# EAGLE design BARBOT (EAGLE 8.6.1)
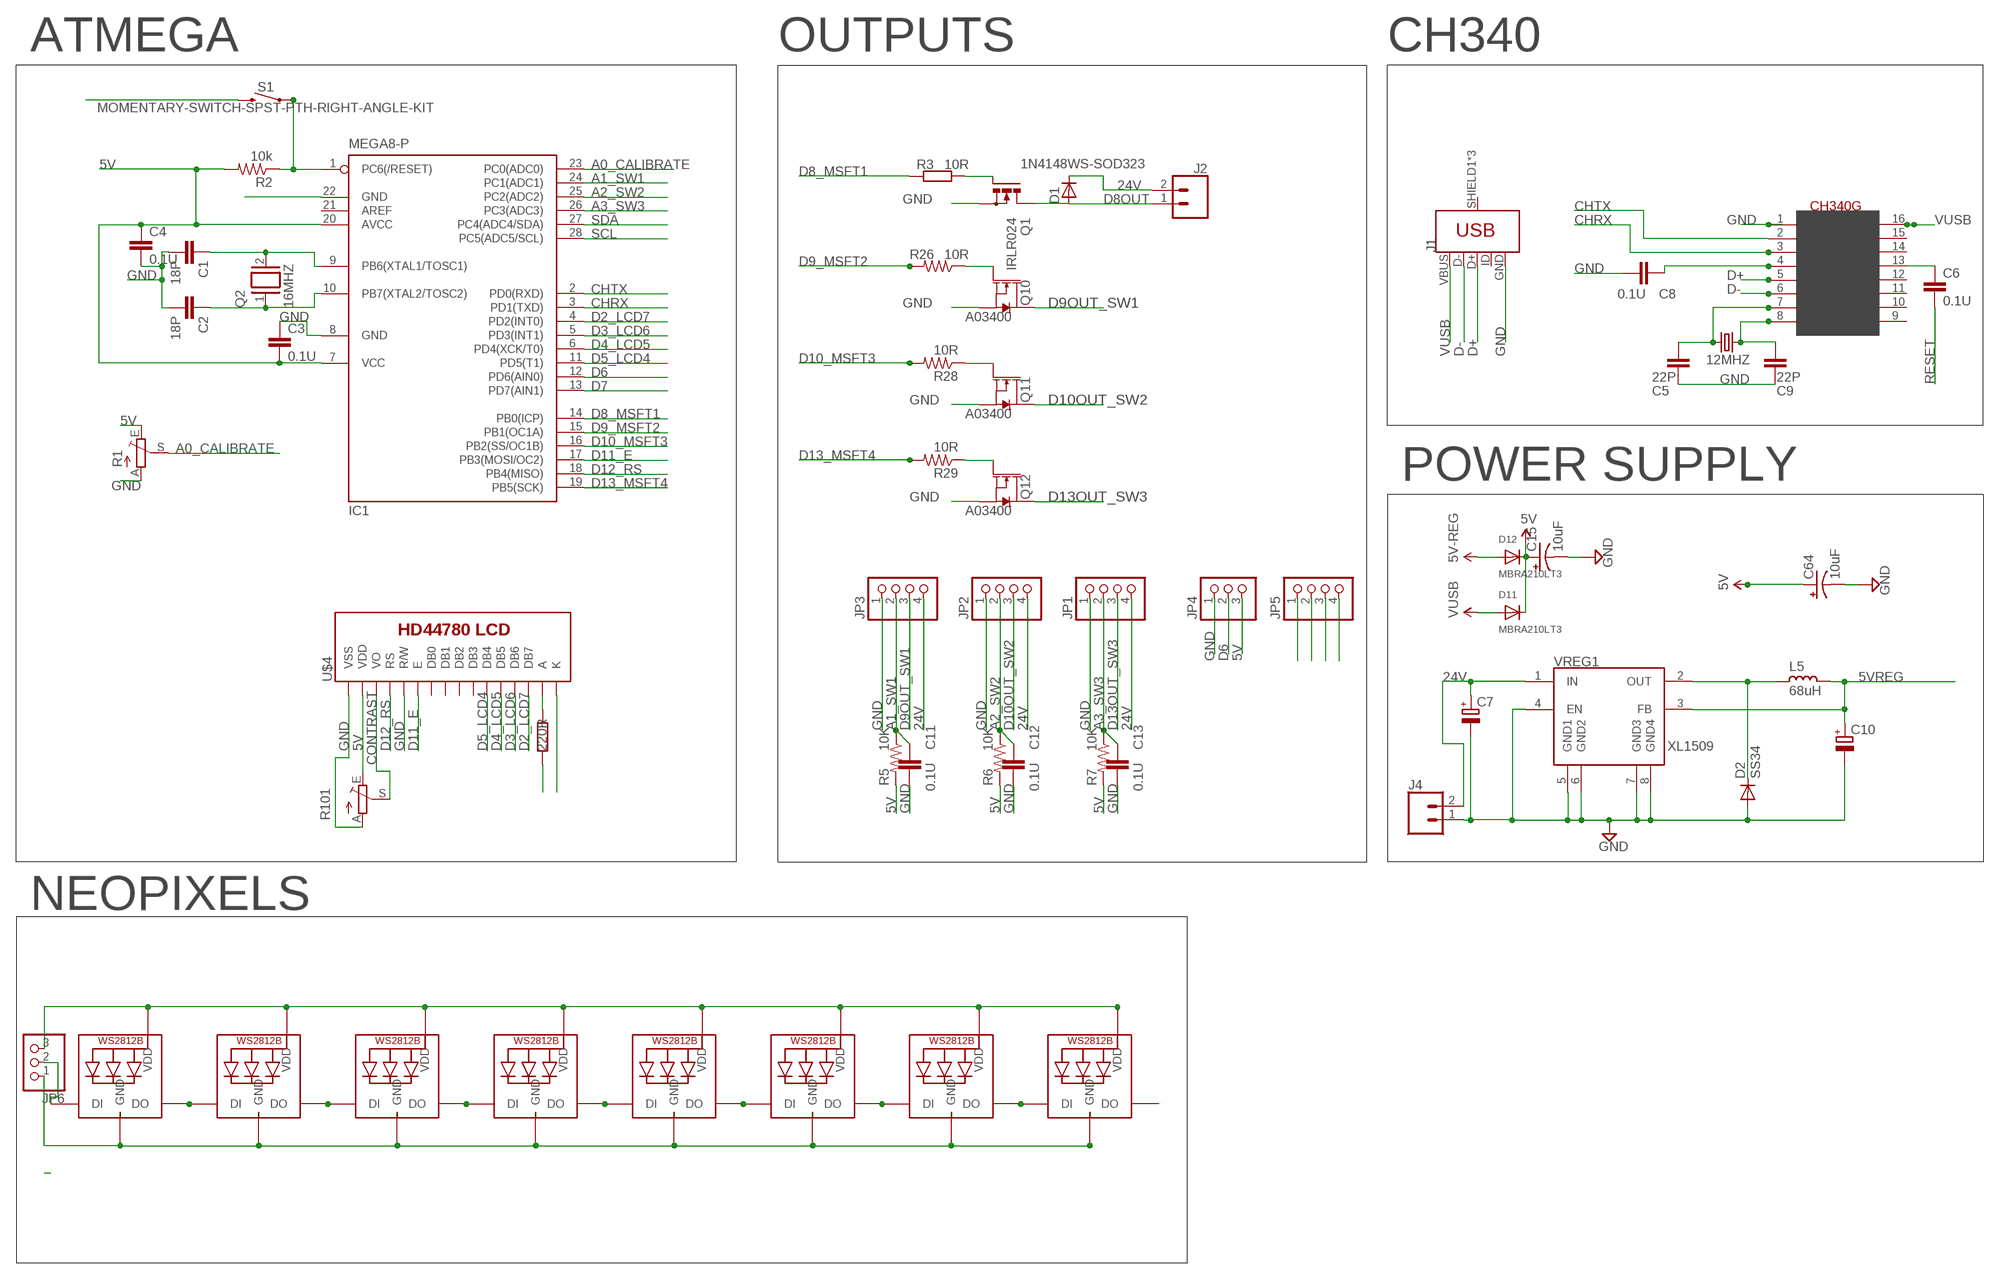
[diagram p0: schematic, sheet 1]

## Parts
12MHZ  12MHZ  CRYSTALHC49U70  [HC49U70]
C1  18P  C-EUC1206  [C1206]
C2  18P  C-EUC1206  [C1206]
C3  0.1U  C-EUC1206  [C1206]
C4  0.1U  C-EUC1206  [C1206]
C5  22P  C-EUC1206  [C1206]
C6  0.1U  C-EUC1206  [C1206]
C7  CPOL-EUE3.5-10  [E3,5-10]
C8  0.1U  C-EUC1206  [C1206]
C9  22P  C-EUC1206  [C1206]
C10  CPOL-EUE3.5-10  [E3,5-10]
C11  0.1U  C-EUC1206  [C1206]
C12  0.1U  C-EUC1206  [C1206]
C13  0.1U  C-EUC1206  [C1206]
C15  10uF  CAP_POL1206  [EIA3216]
C64  10uF  CAP_POL1206  [EIA3216]
D1  1N4148WS-SOD323  D-SOD-80  [SOD80]
D2  SS34  DIODE-DO-214AC  [DO-214AC]
D11  MBRA210LT3  DIODESMA  [SMADIODE]
D12  MBRA210LT3  DIODESMA  [SMADIODE]
IC1  MEGA8-P  [DIL28-3]
J1  USB_MICRO-BREDUCED_PASTE  [USB-B-MICRO-SMD_RED_PASTE]
J2  CONN_023.5MM  [SCREWTERMINAL-3.5MM-2]
J4  CONN_023.5MM  [SCREWTERMINAL-3.5MM-2]
JP1  PINHD-1X4  [1X04]
JP2  PINHD-1X4  [1X04]
JP3  PINHD-1X4  [1X04]
JP4  PINHD-1X3  [1X03]
JP5  PINHD-1X4  [1X04]
JP6  PINHD-1X3  [1X03]
L5  68uH  L_CD75  [CD75]
LED1  WS2812B5050  [WS2812B]
LED2  WS2812B5050  [WS2812B]
LED3  WS2812B5050  [WS2812B]
LED4  WS2812B5050  [WS2812B]
LED5  WS2812B5050  [WS2812B]
LED6  WS2812B5050  [WS2812B]
LED7  WS2812B5050  [WS2812B]
LED8  WS2812B5050  [WS2812B]
Q1  IRLR024  N-POWER-MOSFETDPAK-MOSFET  [D-PAK_TO252AA]
Q2  16MHZ  XTAL/S  [QS]
Q10  A03400  MOSFET-NCH-AO3404A  [SOT23-3]
Q11  A03400  MOSFET-NCH-AO3404A  [SOT23-3]
Q12  A03400  MOSFET-NCH-AO3404A  [SOT23-3]
R1  TRIM_EU-B25P  [B25P]
R2  10k  R-US_R1206  [R1206]
R3  10R  R-EU_R1206  [R1206]
R4  220R  R-EU_R1206  [R1206]
R5  10K  R-US_R1206  [R1206@1]
R6  10K  R-US_R1206  [R1206@1]
R7  10K  R-US_R1206  [R1206@1]
R26  10R  R-US_R1206  [R1206@1]
R28  10R  R-US_R1206  [R1206@1]
R29  10R  R-US_R1206  [R1206@1]
R101  TRIM_EU-B25P  [B25P]
S1  MOMENTARY-SWITCH-SPST-PTH-RIGHT-ANGLE-KIT  [TACTILE_SWITCH_PTH_RIGHT_ANGLE_KIT]
U$2  CH340G  [SOIC16]
U$4  LCD-HD447804-HOLES16X2-4-HOLES  [LCD-16X2-4HOLES]
VREG1  XL1509  [SO08]

## Nets
5V: C3.2 C4.1 C15.A(+) C64.A(+) D11.C D12.C IC1.7(VCC) IC1.20(AVCC) JP4.3 JP5.2 JP6.3 LED1.1-VDD(VDD) LED2.1-VDD(VDD) LED3.1-VDD(VDD) LED4.1-VDD(VDD) LED5.1-VDD(VDD) LED6.1-VDD(VDD) LED7.1-VDD(VDD) LED8.1-VDD(VDD) R1.E R2.2 R4.1 R5.2 R6.2 R7.2 R101.E U$4.2(VDD)
5VREG: C10.+ D12.A L5.1 VREG1.3(FB) ; supply symbol labelled 5V-REG
24V: C7.+ D1.1(C) J2.2 J4.2 JP1.4 JP2.4 JP3.4 VREG1.1(IN)
A0_CALIBRATE: IC1.23(PC0(ADC0)) R1.S
A1_SW1: C11.1 IC1.24(PC1(ADC1)) JP3.2 R5.1
A2_SW2: C12.1 IC1.25(PC2(ADC2)) JP2.2 R6.1
A3_SW3: C13.1 IC1.26(PC3(ADC3)) JP1.2 R7.1
CHRX: IC1.3(PD1(TXD)) U$2.3(RX)
CHTX: IC1.2(PD0(RXD)) U$2.2(TX)
CONTRAST: R101.S U$4.3(VO)
D2_LCD7: IC1.4(PD2(INT0)) U$4.14(DB7)
D3_LCD6: IC1.5(PD3(INT1)) U$4.13(DB6)
D4_LCD5: IC1.6(PD4(XCK/T0)) U$4.12(DB5)
D5_LCD4: IC1.11(PD5(T1)) U$4.11(DB4)
D6: IC1.12(PD6(AIN0)) JP4.2
D7: IC1.13(PD7(AIN1))
D8_MSFT1: IC1.14(PB0(ICP)) R3.1
D8OUT: D1.2(A) J2.1 Q1.4(D)
D9_MSFT2: IC1.15(PB1(OC1A)) R26.2
D9OUT_SW1: JP3.3 Q10.3(D)
D10_MSFT3: IC1.16(PB2(SS/OC1B)) R28.2
D10OUT_SW2: JP2.3 Q11.3(D)
D11_E: IC1.17(PB3(MOSI/OC2)) U$4.6(E)
D12_RS: IC1.18(PB4(MISO)) U$4.4(RS)
D13_MSFT4: IC1.19(PB5(SCK)) R29.2
D13OUT_SW3: JP1.3 Q12.3(D)
D+: J1.D+ U$2.5(D+)
D-: J1.D- U$2.6(D-)
GND: C1.2 C2.2 C3.1 C4.2 C5.2 C7.- C8.2 C9.2 C10.- C11.2 C12.2 C13.2 C15.C(-) C64.C(-) D2.2(A) IC1.8(GND) IC1.22(GND) J1.GND J4.1 JP1.1 JP2.1 JP3.1 JP4.1 JP5.1 JP6.1 LED1.3-GND(GND) LED2.3-GND(GND) LED3.3-GND(GND) LED4.3-GND(GND) LED5.3-GND(GND) LED6.3-GND(GND) LED7.3-GND(GND) LED8.3-GND(GND) Q1.3(S) Q10.2(S) Q11.2(S) Q12.2(S) R1.A R101.A S1.2 U$2.1(GND) U$4.1(VSS) U$4.5(R/W) U$4.16(K) VREG1.4(EN) VREG1.5(GND1) VREG1.6(GND2) VREG1.7(GND3) VREG1.8(GND4)
N$1: Q1.1(G) R3.2
N$2: C6.1 U$2.13(DTR)
N$3: C1.1 IC1.9(PB6(XTAL1/TOSC1)) Q2.2
N$5: C2.1 IC1.10(PB7(XTAL2/TOSC2)) Q2.1
N$9: 12MHZ.1 C5.1 U$2.7(XI)
N$10: R4.2 U$4.15(A)
N$11: 12MHZ.2 C9.1 U$2.8(XO)
N$12: C8.1 U$2.4(V3)
N$17: LED1.2-DOUT(DO) LED2.4-DIN(DI)
N$18: LED2.2-DOUT(DO) LED3.4-DIN(DI)
N$19: LED3.2-DOUT(DO) LED4.4-DIN(DI)
N$20: LED4.2-DOUT(DO) LED5.4-DIN(DI)
N$21: LED5.2-DOUT(DO) LED6.4-DIN(DI)
N$22: LED6.2-DOUT(DO) LED7.4-DIN(DI)
N$23: LED7.2-DOUT(DO) LED8.4-DIN(DI)
N$27: JP6.2 LED1.4-DIN(DI)
N$81: Q10.1(G) R26.1
N$82: Q11.1(G) R28.1
N$83: Q12.1(G) R29.1
N$292: D2.1(C) L5.2 VREG1.2(OUT)
RESET: C6.2 IC1.1(PC6(/RESET)) R2.1 S1.1
SCL: IC1.28(PC5(ADC5/SCL)) JP5.4
SDA: IC1.27(PC4(ADC4/SDA)) JP5.3
VUSB: D11.A J1.VBUS U$2.16(VCC)
Unconnected: IC1.21(AREF) J1.ID J1.SHIELD1(SHIELD) J1.SHIELD2(SHIELD) J1.SHIELD3(SHIELD) LED8.2-DOUT(DO) U$2.9(CTS) U$2.10(DSR) U$2.11(RI) U$2.12(DCD) U$2.14(RTS) U$2.15(RS232) U$4.7(DB0) U$4.8(DB1) U$4.9(DB2) U$4.10(DB3)

## Notes on the sheet
- ATMEGA | OUTPUTS | CH340
- POWER SUPPLY
- NEOPIXELS

## Library data of the parts
12MHZ = crystal:CRYSTAL: CRYSTAL; OC_FARNELL: unknown; OC_NEWARK: unknown
C1-C6 C8 C9 C11-C13 = rcl:C-EU: CAPACITOR, European symbol; SPICEPREFIX: C
C7 C10 = rcl:CPOL-EU: POLARIZED CAPACITOR, European symbol; SPICEPREFIX: C
C15 C64 = SparkFun:CAP_POL: Capacitor Polarized These are standard SMD and PTH capacitors. Normally 10uF, 47uF, and 100uF in electrolytic and tantalum varieties. Always verify the external diameter of the through hole cap, it varies with capacity, voltage, and manufacturer. The EIA devices should be standard.
D1 = semicon-smd-ipc:D-: DIODE unfilled
D2 = dp_devices:DIODE: Various Diode Packages
D11 D12 = microbuilder:DIODE: Diode SMADIODE - SMA Surface Mount Package 20V 1A Schottky Diode Digikey (500mV @ 1A, 500uA Vr @ 20V): 641-1014-6-ND 10V 2A Schottky Diode Digikey (350mV @ 2A, 700uA Vr @ 10V): MBRA210LT3 SOD-123 30V 200mA (800mV Vf, 2uA Vr @ 25V) Schottky Diode (very fast switching for boost, etc.) - Digikey: BAT54T1GOSTR-ND 30V 500mA (430mV Vf, 130uA Vr @ 30V) Schottky Diode - Digikey: B0530W-FDICT-ND MBR120 1A 20V (0.34Vf) Schottky Diode - Digikey: MBR120VLSFT1GOSCT-ND SOD-323 10V 570mA (380mV Vf, 3ns) Schottky Diode - Digikey: ZLLS410CT-ND 1N4148WS - 75V 150mA (1V Vf @ 10mA, 4ns) Simple Diode - Digikey: 1N4148WSFSCT-ND, Mouser: 512-1N4148WS SOD-523 BAT54 30V 200mA Schottky (0.8 Vf @ 100mA, 5ns) - Digikey: BAT54XV2CT-ND 30V 30mA Schottky Diode (RB751S-40TE61) - Digikey: RB751S-40TE61CT-ND SOT23-R/W - SOT23 Package (R = Solder Paste/Reflow Ovens, W = Hand-Soldering) BAT54Film 40V 300mA - Digikey: 497-7162-1-ND DO-1N4148 Through Hole Small Current Diode (any model)
IC1 = atmel:MEGA8-P: MICROCONTROLLER 8 Kbytes FLASH, 1 kbytes SRAM, 512 bytes EEPROM, USART, 4-channel 10 bit ADC, 2-channel 8 bit ADC Pin compatible with Atmega48, ATMega88, ATMega168 Source: avr.lbr; OC_FARNELL: unknown; OC_NEWARK: unknown
J1 = SparkFun-Connectors:USB_MICRO-B: USB Type Micro-B Connector Male/female and PTH/SMT variants SparkFun Products: SparkFun microB USB Breakout <https://www.sparkfun.com/products/12035> SparkFun USB microB Plug Breakout <https://www.sparkfun.com/products/10031> SparkFun ESP8266 Thing <https://www.sparkfun.com/products/13231>; PROD_ID: CONN-11752
J2 J4 = SparkFun-Connectors:CONN_02: Multi connection point. Often used as Generic Header-pin footprint for 0.1 inch spaced/style header connections On any of the 0.1 inch spaced packages, you can populate with these: Break Away Headers - Straight <https://www.sparkfun.com/products/116> (PRT-00116) Break Away Male Headers - Right Angle <https://www.sparkfun.com/products/553> (PRT-00553) Female Headers <https://www.sparkfun.com/products/115> (PRT-00115) Break Away Headers - Machine Pin <https://www.sparkfun.com/products/117> (PRT-00117) Break Away Female Headers - Swiss Machine Pin <https://www.sparkfun.com/products/743> (PRT-00743) For SCREWTERMINALS and SPRING TERMINALS visit here: Screw Terimnals on SparkFun.com <https://www.sparkfun.com/search/results?term=Screw+Terminals> (5mm/3.5mm/2.54mm spacing) This device is also useful as a general connection point to wire up your design to another part of your project. Our various solder wires solder well into these plated through hole pads. Hook-Up Wire - Assortment (Stranded, 22 AWG) <https://www.sparkfun.com/products/11375> (PRT-11375) Hook-Up Wire - Assortment (Solid Core, 22 AWG) <https://www.sparkfun.com/products/11367> (PRT-11367) View the entire wire category on our website here <https://www.sparkfun.com/categories/141> Special notes: Molex polarized connector foot print use with: PRT-08233 with associated crimp pins and housings. 2.54_SCREWTERM for use with PRT-10571. 3.5mm Screw Terminal footprints for PRT-08084 5mm Screw Terminal footprints for use with PRT-08432; PROD_ID: CONN-08399
JP1-JP3 JP5 = pinhead:PINHD-1X4: PIN HEADER
JP4 JP6 = pinhead:PINHD-1X3: PIN HEADER
L5 = rc-master-smd:L_: INDUCTOR
LED1-LED8 = adafruit:WS2812B
Q1 = Cohesion_parts:N-POWER-MOSFET
Q2 = special:XTAL/S: CRYSTAL
Q10-Q12 = SparkFun-DiscreteSemi:MOSFET-NCH: N-channel MOSFETs Voltage controlled devices that allow control of high current outputs. SparkFun Products: SparkFun OpenScale <https://www.sparkfun.com/products/13261> SparkFun Digital Sandbox <https://www.sparkfun.com/products/12651> SparkFun Monster Moto Shield <https://www.sparkfun.com/products/10182> SparkFun MOSFET Power Controller <https://www.sparkfun.com/products/11214>; PROD_ID: TRANS-12988; VALUE: 5.8A/30V/35mΩ
R1 R101 = pot:TRIM_EU-: POTENTIOMETER
R2 = resistor:R-US_: RESISTOR, American symbol
R3 R4 = resistor:R-EU_: RESISTOR, European symbol
R5-R7 R26 R28 R29 = rcl:R-US_: RESISTOR, American symbol
S1 = SparkFun-Switches:MOMENTARY-SWITCH-SPST: Momentary Switch (Pushbutton) - SPST Normally-open (NO) SPST momentary switches (buttons, pushbuttons). Variants PTH-12MM - 12mm square, through-hole Momentary Pushbutton Switch - 12mm Square <https://www.sparkfun.com/products/9190> (COM-09190) PTH-6.0MM, PTH-6.0MM-KIT - 6.0mm square, through-hole Mini Pushbutton Switch <https://www.sparkfun.com/products/97> (COM-00097) KIT package intended for soldering kit's - only one side of pads' copper is exposed. PTH-RIGHT-ANGLE-KIT - Right-angle, through-hole Right Angle Tactile Button <https://www.sparkfun.com/products/10791> - Used on SparkFun BigTime Watch Kit <https://www.sparkfun.com/products/11734> SMD-12MM - 12mm square, surface-mount Tactile Button - SMD (12mm) <https://www.sparkfun.com/products/12993> (COM-12993) Used on SparkFun PicoBoard <https://www.sparkfun.com/products/11888> SMD-4.5MM - 4.5mm Square Trackball Switch Used on SparkFun Blackberry Trackballer Breakout <https://www.sparkfun.com/products/13169> SMD-4.6MMX2.8MM - 4.60mm x 2.80mm, surface mount Used on SparkFun SAMD21 Mini Breakout <https://www.sparkfun.com/products/13664> SMD-5.2MM, SMD-5.2-REDUNDANT - 5.2mm square, surface-mount Mini Pushbutton Switch - SMD <https://www.sparkfun.com/products/8720> (COM-08720) Used on Arduino Pro Mini <https://www.sparkfun.com/products/11114> REDUNDANT package connects both switch circuits together SMD-6.0X3.5MM - 6.0 x 3.5mm, surface mount Momentary Reset Switch SMD <https://www.sparkfun.com/products/8229> (COM-08229) SMD-6.2MM-TALL - 6.2mm square, surface mount Tactile Button - SMD (6mm) <https://www.sparkfun.com/products/12992> Used on SparkFun Digital Sandbox <https://www.sparkfun.com/products/12651> SMD-RIGHT-ANGLE - Right-angle, surface mount Used on SparkFun Block for Intel® Edison - Arduino <https://www.sparkfun.com/products/13036>; PROD_ID: CONN-10672; SF_SKU: COM-10791
U$2 = usb-serial:CH340G
U$4 = HD44780LCD:LCD-HD44780
VREG1 = Cohesion_parts:XL1509

## Net classes
0 default: width 0.254 mm, clearance 0.254 mm
1 power: width 0.6 mm, clearance 0.305 mm
5 3.3-Amp Class: width 1.27 mm

## Board
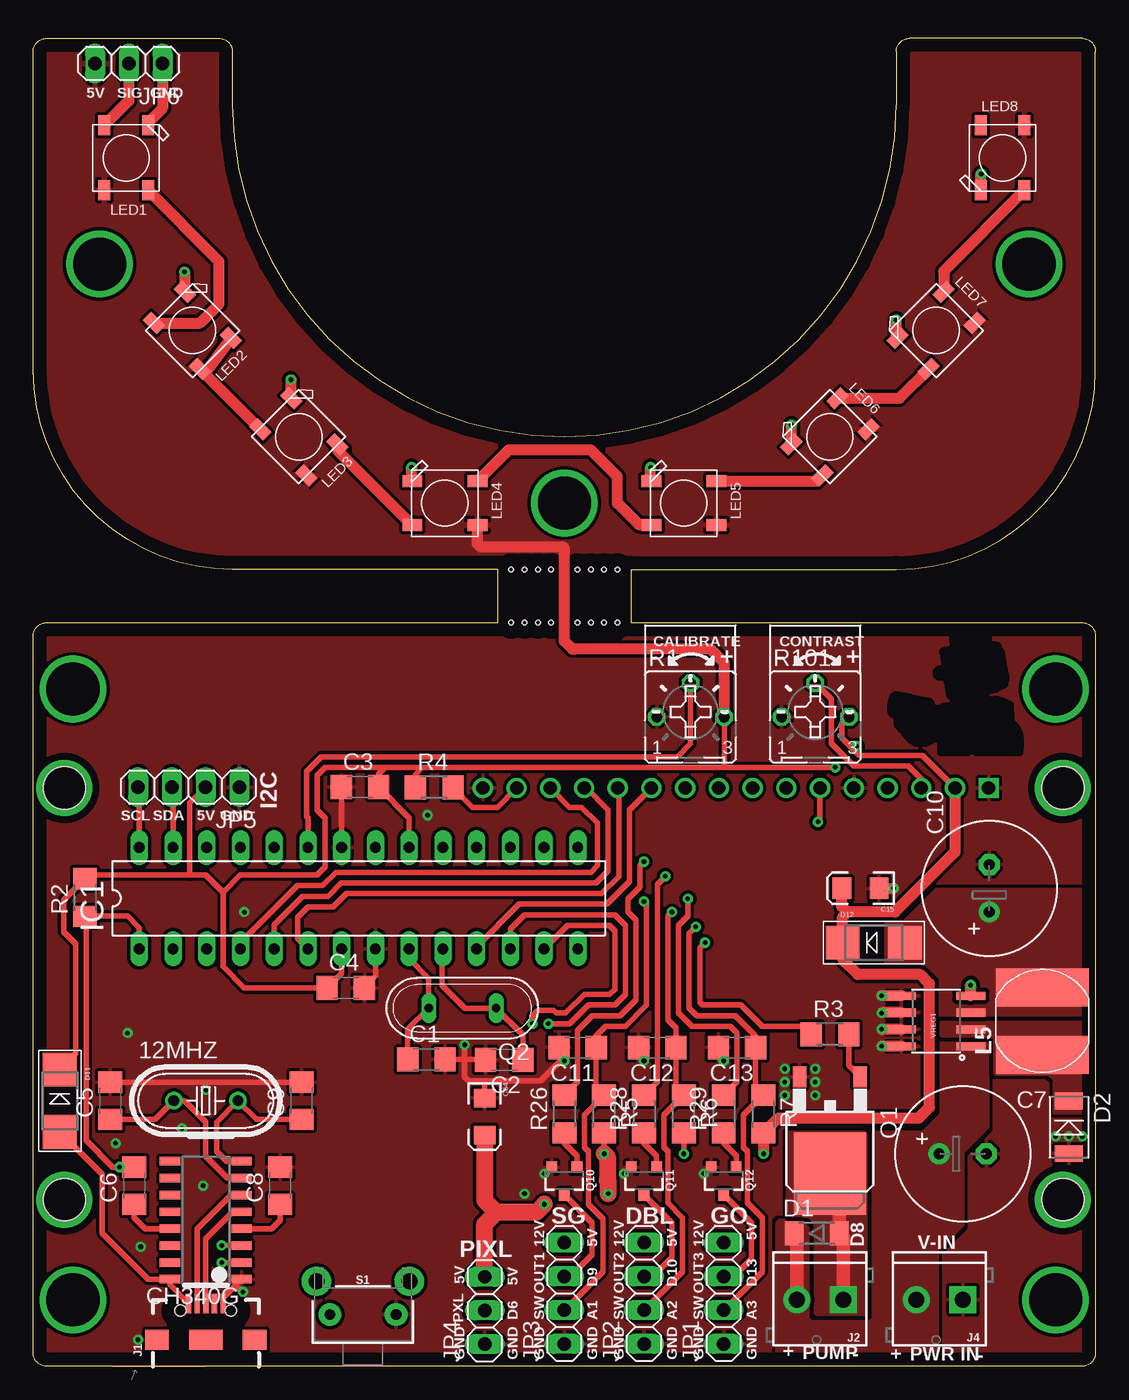
[diagram p1: board, top side]
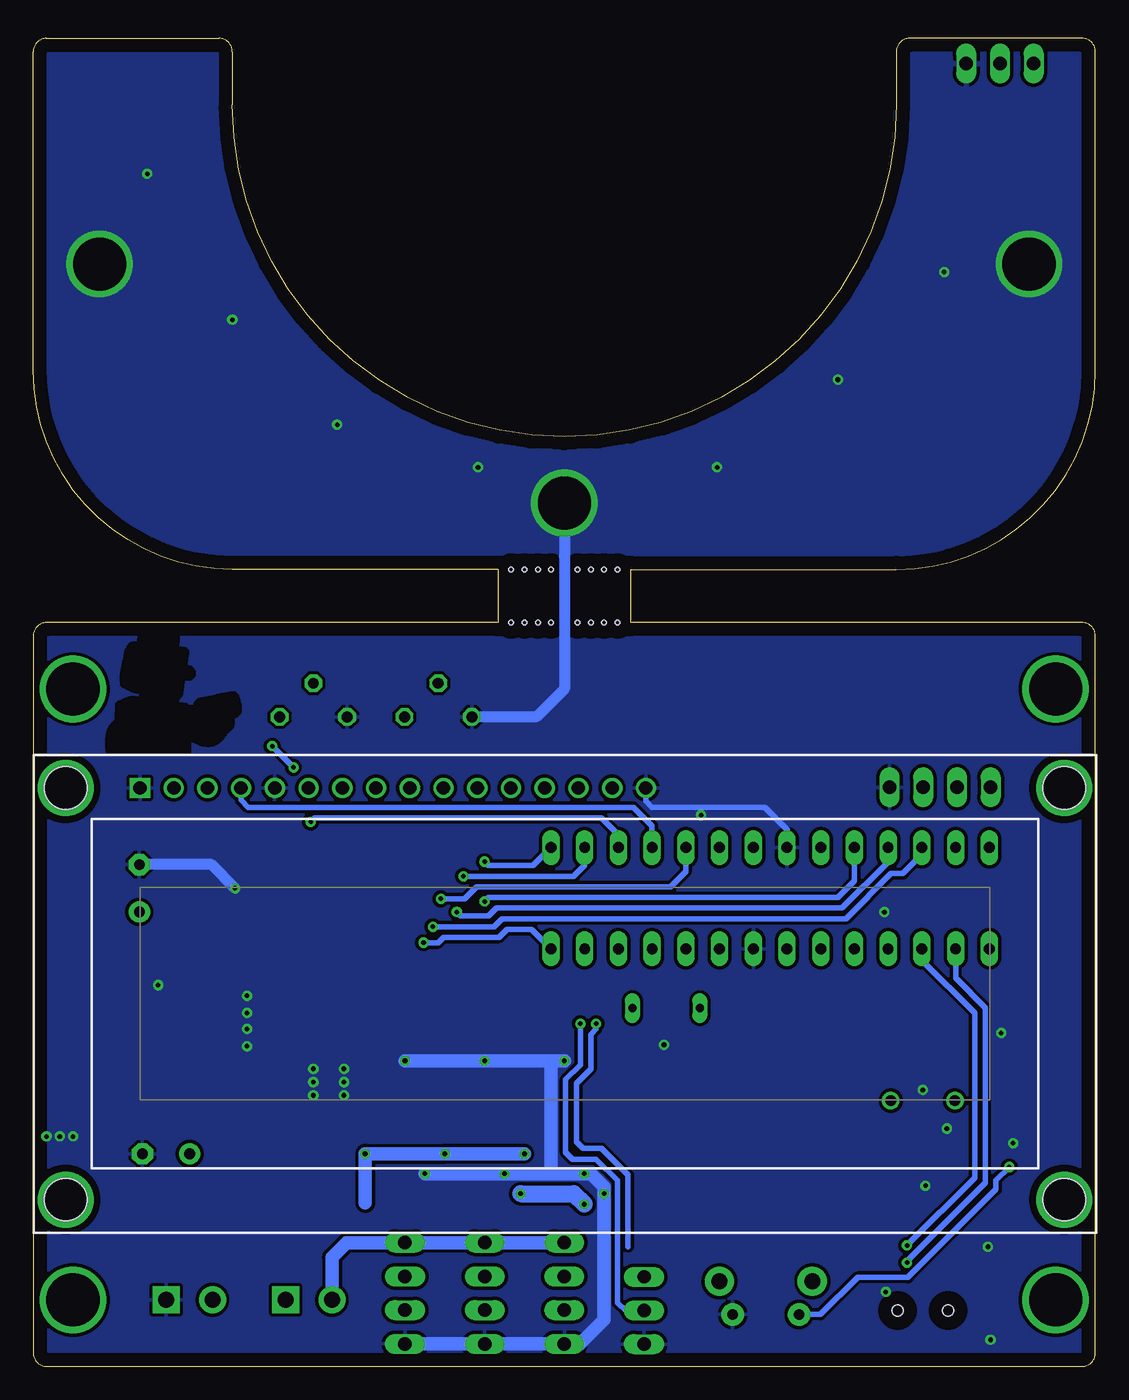
[diagram p2: board, bottom side, seen from below]

Size 80 x 100 mm. Coordinates in mm from the lower left corner, seen from the top.
Outline: 79,0 1,0 arc-90 0,1 0,55 arc-90 1,56 35,56 35,60 15,60 arc-90 0,75 0,99 arc-90 1,100 14,100 arc-90 15,99 15,95 arc180 65,95 65,99 arc-90 66,100 79,100 arc-90 80,99 80,75 arc-90 65,60 45,60 45,56 79,56 arc-90 80,55 80,1 arc-90 79,0
Copper layers (1*16): Top 0.035mm / dielectric 1.5mm / Bottom 0.035mm
Design rules "default": minimum track width 6mil, minimum drill 0.35mm, track to track 6mil, track to pad 6mil, pad to pad 6mil, via to via 6mil, smd to smd 6mil, copper to edge 40mil, drill to drill 6mil, minimum pad ring 10mil, minimum via ring 8mil, stop-mask expansion 4mil, vias tented up to drill 0mil, thermal gap 10mil
Holes 0.35 mm at 36,56 37,56 38,56 39,56 41,56 42,56 43,56 44,56 44,60 43,60 42,60 41,60 39,60 38,60 37,60 36,60
tRestrict: area 68.3,46.2 to 68.4,46.2; area 68.8,46.2 to 68.9,46.2; area 69.2,46.2 to 70,46.2; area 70,46.2 to 70.4,46.2; area 71,46.2 to 74.3,46.2; area 68.3,46.2 to 68.4,46.3; area 68.8,46.2 to 68.9,46.3; area 69.2,46.2 to 70,46.3; area 70.1,46.2 to 70.4,46.3; area 71,46.2 to 74.3,46.3; area 68.3,46.3 to 68.4,46.3; area 68.8,46.3 to 68.9,46.3; 1841 more areas
bRestrict: area 68.3,46.2 to 68.4,46.2; area 68.8,46.2 to 68.9,46.2; area 69.2,46.2 to 70,46.2; area 70,46.2 to 70.4,46.2; area 71,46.2 to 74.3,46.2; area 68.3,46.2 to 68.4,46.3; area 68.8,46.2 to 68.9,46.3; area 69.2,46.2 to 70,46.3; area 70.1,46.2 to 70.4,46.3; area 71,46.2 to 74.3,46.3; area 68.3,46.3 to 68.4,46.3; area 68.8,46.3 to 68.9,46.3; 1841 more areas

### Footprints (pad centres in the part's own frame; a part is rotated, then mirrored left to right if it is on the bottom)
HC49U70 = drill 0.813: 1 -2.413,0; 2 2.413,0
C1206 = smd 1.6 x 1.8: 1 -1.4,0; 2 1.4,0
E3,5-10 = drill 0.813 pad 1.6: + -1.778,0 | drill 0.813 pad 1.6 octagon: - 1.778,0
EIA3216 = smd 1.4 x 1.6: A 1.4,0; C -1.4,0
SOD80 = smd 1.4 x 1.8: 1 -1.7,0; 2 1.7,0
DO-214AC = smd 1.27 x 2.1: 1 -1.98,0; 2 1.98,0
SMADIODE = smd 2.54 x 2.54: A 2.349,0; C -2.349,0
DIL28-3 = drill 0.813 long: 1 -16.51,-3.81; 2 -13.97,-3.81; 3 -11.43,-3.81; 4 -8.89,-3.81; 5 -6.35,-3.81; 6 -3.81,-3.81; 7 -1.27,-3.81; 8 1.27,-3.81; 9 3.81,-3.81; 10 6.35,-3.81; 11 8.89,-3.81; 12 11.43,-3.81; 13 13.97,-3.81; 14 16.51,-3.81; 15 16.51,3.81; 16 13.97,3.81; 17 11.43,3.81; 18 8.89,3.81; 19 6.35,3.81; 20 3.81,3.81; 21 1.27,3.81; 22 -1.27,3.81; 23 -3.81,3.81; 24 -6.35,3.81; 25 -8.89,3.81; 26 -11.43,3.81; 27 -13.97,3.81; 28 -16.51,3.81
USB-B-MICRO-SMD_RED_PASTE = smd 1.45 x 0.4: D+ 2.725,0; D- 2.725,0.65; GND 2.725,-1.3; ID 2.725,-0.65; VBUS 2.725,1.3 | smd 1.5 x 1.8: SHIELD1 0,3.685; SHIELD2 0,-3.685 | smd 1.5 x 2.5: SHIELD3 0,0 | hole 0.85: 2.2,1.9; 2.2,-1.9
SCREWTERMINAL-3.5MM-2 = drill 1.2 pad 2.032 square: 1 0,0 | drill 1.2 pad 2.032: 2 3.5,0
1X04 = drill 1.016 long: 1 -3.81,0; 2 -1.27,0; 3 1.27,0; 4 3.81,0
1X03 = drill 1.016 long: 1 -2.54,0; 2 0,0; 3 2.54,0
CD75 = smd 7 x 2.85: 1 0,2.54; 2 0,-2.54
WS2812B = smd 1.5 x 0.9: 1-VDD 2.45,-1.65; 2-DOUT 2.45,1.65; 3-GND -2.45,1.65; 4-DIN -2.45,-1.65
D-PAK_TO252AA = smd 1 x 1.6: 1 -2.28,-4.8; 3 2.28,-4.8 | smd 5.4 x 6.2: 4 0,2.5
QS = drill 0.61 long: 1 -2.54,0; 2 2.54,0
SOT23-3 = smd 0.8 x 0.9: 1 -0.95,-1; 2 0.95,-1; 3 0,1.1
B25P = drill 0.813 octagon: A -2.54,0; E 2.54,0; S 0,2.54
R1206 = smd 1.6 x 1.803: 1 -1.422,0; 2 1.422,0
R1206@1 = smd 1.6 x 1.803: 1 -1.422,0; 2 1.422,0
TACTILE_SWITCH_PTH_RIGHT_ANGLE_KIT = drill 0.8 pad 1.7: 1 -2.5,0; 2 2.5,0 | drill 1.2 pad 2.2: ANCHOR1 -3.5,2.5; ANCHOR2 3.5,2.5
SOIC16 = smd 0.635 x 1.524: 1 -4.445,-2.695; 2 -3.175,-2.695; 3 -1.905,-2.695; 4 -0.635,-2.695; 5 0.635,-2.695; 6 1.905,-2.695; 7 3.175,-2.695; 8 4.445,-2.695; 9 4.445,2.695; 10 3.175,2.695; 11 1.905,2.695; 12 0.635,2.695; 13 -0.635,2.695; 14 -1.905,2.695; 15 -3.175,2.695; 16 -4.445,2.695
LCD-16X2-4HOLES = drill 1.016 square: 1 -32,15.5 | drill 1.016: 2 -29.46,15.5; 3 -26.92,15.5; 4 -24.38,15.5; 5 -21.84,15.5; 6 -19.3,15.5; 7 -16.76,15.5; 8 -14.22,15.5; 9 -11.68,15.5; 10 -9.14,15.5; 11 -6.6,15.5; 12 -4.06,15.5; 13 -1.52,15.5; 14 1.02,15.5; 15 3.56,15.5; 16 6.1,15.5 | hole 3.2: -37.6,15.5; -37.6,-15.5; 37.6,-15.5; 37.6,15.5
SO08 = smd 0.61 x 2.21: 1 -1.905,-2.616; 2 -0.635,-2.616; 3 0.635,-2.616; 4 1.905,-2.616; 5 1.905,2.616; 6 0.635,2.616; 7 -0.635,2.616; 8 -1.905,2.616

### Placement (x,y rotation side)
12MHZ  13,20 0 top
C1  29.61,23.11 0 top
C2  35.47,23.09 180 top
C3  24.61,43.61 0 top
C4  23.54,28.51 0 top
C5  5.8,20 90 top
C6  7.6,13.6 90 top
C7  70,16 0 top
C8  18.6,13.6 90 top
C9  20.2,20 90 top
C10  72,36 90 top
C11  41,24 180 top
C12  47,24 180 top
C13  53,24 180 top
C15  62.3,36 180 top
C64  34,18.8 270 top
D1  59,10 0 top
D2  78,18 270 top
D11  2,20 270 top
D12  63.3,31.9 0 top
IC1  24.5,35.25 0 top
J1  13,2 90 top
J2  61,5 180 top
J4  70,5 180 top
JP1  52,5.5 90 top
JP2  46,5.5 90 top
JP3  40,5.5 90 top
JP4  34,4.2 90 top
JP5  11.7,43.6 180 top
JP6  7.2,98.1 180 top
L5  76,26 0 top
LED1  7,91 270 top
LED2  12,78 315 top
LED3  20,70 315 top
LED4  31,65 0 top
LED5  49,65 0 top
LED6  60,70 45 top
LED7  68,78 45 top
LED8  73,91 90 top
Q1  60,17 180 top
Q2  32.33,26.97 180 top
Q10  40,14 180 top
Q11  46,14 180 top
Q12  52,14 180 top
R1  49.5,48.9 0 top
R2  3.9,35.3 90 top
R3  60,25 0 top
R4  30.2,43.6 0 top
R5  43,19 270 top
R6  49,19 270 top
R7  55,19 270 top
R26  40,19 90 top
R28  46,19 90 top
R29  52,19 90 top
R101  58.9,48.9 0 top
S1  24.83,3.91 0 top
U$2  13,11 90 top
U$4  39.96,28.05 0 bottom
VREG1  68,26 90 top

### Tracks (layer width: path | path; a pad name or v marks a point on that pad's centre or on a via)
5V  (via drill 0.35)
  Top 0.406: R5.2 v43,16 | v49,16 R6.2 | U$4.2 66.97,46 62.2,46 61.75,46.45 | 61.75,46.45 60.9,47.3 60.9,48.36 R101.E | IC1.7 23.23,29.6 C4.1 15.89,28.51 14.3,30.1 14.3,35.7 | 52,45.1 v60.4,45.1 | v62,46.7 61.75,46.45 | R1.E 52.04,45.14 52,45.1 | R4.1 28.78,44.58 29.3,45.1 | 52,45.1 29.3,45.1 | IC1.20 28.31,41.31 C3.2 26,44.6 26.5,45.1 | 29.3,45.1 26.5,45.1 | 26.5,45.1 22,45.1 21.4,44.5 21.4,41.9 22,41.3 22,37.6 21.4,37 15.6,37 14.3,35.7 | 14.3,35.7 13,37 11.8,37 | 11.8,37 4.18,37 R2.2 2.3,35.12 2.3,32.7 3.2,31.8 3.2,23.55 D11.C | 11.8,37 11.8,42.43 JP5.2
  Top 0.813: v55,16 R7.2 56.12,18.7 66.7,18.7 67.5,19.5 67.5,28.8 66.8,29.5 62.1,29.5 60.95,30.65 D12.C 60.95,33.85 61.3,34.2 | U$4.2 69.42,38.72 64.9,34.2 61.3,34.2 | 61.3,34.2 60.9,34.6 C15.A | R1.E 52.04,52.96 51,54 40.8,54 40.6,54 40,54.6 40,61.6 39.9,61.7 33.7,61.7 33.45,61.95 LED4.1-VDD
  Top 1.27: v43.3,13 43.3,13.91 43.23,13.97 43.23,15.77 v43,16 | v38.5,12.2 37.9,11.6 34.9,11.6 | 34.9,11.6 34,12.5 C64.A | JP4.3 34,10.7 34.9,11.6
  Bottom 0.406: v60.4,45.1 v62,46.7
  Bottom 1.016: v43,16 v49,16 v55,16 55,12.31
  Bottom 1.27: v43.3,13 39.3,13 v38.5,12.2
  pour Top: 15,100 0,100 0,75 arc90 15,60 65,60 arc90 79.93,74.93 arc45 80,75.11 80,100 65,100 65,95 arc-180 15,95
5VREG
  pour Top (isolate 0.305, rank 3, no thermals): 68.3,26.3 79.8,26.3 79.8,35.5 79.4,35.9 68,35.9 65.4,33.3 64.2,33.3 64.2,30.3 67.2,30.3 68.3,29.2
24V
  Top 1.016: J2.2 57.5,9.8 D1.1
  Bottom 1.016: JP3.4 JP2.4 JP1.4 56.39,9.31 57.5,8.2 J2.2
  pour Top (isolate 0.305, rank 2, no thermals): 56.2,11 58.1,11 58.5,10.6 58.5,3.8 58.8,3.5 62.9,3.5 63.1,3.7 63.1,17.4 63.3,17.6 67,17.6 68.4,19 68.4,24.4 71.8,24.4 71.9,24.3 71.9,18 70,16.1 70,10.6 68.1,8.7 68.1,0.6 67.7,0.2 56.3,0.2 56,0.5 56,10.8
A0_CALIBRATE
  Top 0.406: R1.S 49.5,46.9 48.5,45.9 21.7,45.9 20.6,44.8 20.6,41.4 20.7,41.3 IC1.23
A1_SW1  (via drill 0.35)
  Top 0.406: JP3.2 42.9,7.13 42.9,11.1 41.8,12.2 41.8,16.2 41.5,16.5 41.5,18.92 R5.1 42.4,21.02 C11.1 42.4,24.9 43.1,25.6 44.6,25.6 46.2,27.2 46.2,34.8 v46,35
  Bottom 0.406: IC1.24 18.15,36.55 19.4,35.3 45.7,35.3 v46,35
A2_SW2  (via drill 0.35)
  Top 0.406: JP2.2 48.9,7.13 48.9,11.2 47.8,12.3 47.8,16.2 47.5,16.5 47.5,18.92 R6.1 48.4,21.02 C12.1 48.4,25.5 47.8,26.1 47.8,33.9 v48.1,34.2
  Bottom 0.406: IC1.25 15.61,37.99 19.1,34.5 45.1,34.5 45.7,33.9 47.8,33.9 v48.1,34.2
A3_SW3  (via drill 0.35)
  Top 0.406: JP1.2 54.9,7.13 54.9,11.2 53.8,12.3 53.8,16.2 53.5,16.5 53.5,18.92 R7.1 54.4,21.02 C13.1 54.4,24.9 52.9,26.4 50,26.4 49.4,27 49.4,32.6 v49.9,33.1
  Bottom 0.406: IC1.26 13.07,38.53 14.5,37.1 15.4,37.1 18.8,33.7 44.7,33.7 45.3,33.1 v49.9,33.1
CHRX  (via drill 0.35)
  Top 0.406: v14.2,9.1 v14.21,9.1 U$2.3
  Bottom 0.406: v14.2,9.1 9.1,14.2 9.1,26.6 13.07,30.57 IC1.3
CHTX  (via drill 0.35)
  Top 0.406: v14.2,7.8 15.67,7.8 U$2.2
  Bottom 0.406: v14.2,7.8 14.2,7.9 8.3,13.8 8.3,27 10.53,29.23 IC1.2
CONTRAST
  Top 0.406: U$4.3 66.88,44.22 65.9,45.2 61.8,45.2 60.1,46.9 60.1,50.24 R101.S
D2_LCD7
  Top 0.406: U$4.14 40.39,42.1 41.3,42.1 42.5,40.9 42.5,37.7 42,37.2 22.8,37.2 21.8,36.2 19.9,36.2 15.61,31.91 IC1.4
D3_LCD6
  Top 0.406: U$4.13 41.65,43.55 43.3,41.9 43.3,37.3 42.4,36.4 23.2,36.4 22.2,35.4 20.3,35.4 18.15,33.25 IC1.5
D4_LCD5
  Top 0.406: U$4.12 44.1,43.47 44.1,36.9 42.8,35.6 23.6,35.6 22.6,34.6 20.7,34.6 19.9,33.8 19.9,32.23 IC1.6
D5_LCD4
  Top 0.406: U$4.11 44.9,41.89 44.9,36.5 43.2,34.8 36.6,34.8 33.39,31.59 IC1.11
D6  (via drill 0.35)
  Top 0.406: v38.8,25.8 40.4,25.8 41.8,27.2 43.8,27.2 44.6,28 44.6,33.2 43.8,34 37,34 35.93,32.93 IC1.12
  Bottom 0.406: JP4.2 35.4,4.2 36,4.8 36,14 37.6,15.6 39.4,15.6 39.9,16.1 39.9,21.6 38.8,22.7 v38.8,25.8
D7  (via drill 0.35)
  Top 0.406: IC1.13 40.23,33.2 43.4,33.2 43.8,32.8 43.8,28.4 43.4,28 41.5,28 40.1,26.6 39.4,26.6 39.2,26.8 38,26.8 37.6,26.4 v37.6,25.8
  Bottom 0.406: v37.6,25.8 37.6,25.4 38,25 38,22.4 39.1,21.3 39.1,16.9 38.6,16.4 37.2,16.4 35.2,14.4 35.2,9
D8_MSFT1  (via drill 0.35)
  Top 0.406: 58.58,24.88 R3.1 57.98,25.6 54.9,25.6 53.3,27.2 50.4,27.2 50.2,27.4 50.2,31.5 v50.6,31.9
  Bottom 0.406: v50.6,31.9 49.5,31.9 49.1,32.3 44.9,32.3 44.3,32.9 42.47,32.9 IC1.14
D8OUT
  Top 1.016: J2.1 61,9.7 D1.2 60.7,13.8 Q1.4
  pour Top (isolate 0.305, no thermals): 56.8,17.5 56.8,11.7 57.2,11.3 58.4,11.3 58.9,10.8 58.9,4 59,3.9 62.6,3.9 62.7,4 62.7,17.5 62.6,17.6 56.9,17.6
D9_MSFT2  (via drill 0.35)
  Top 0.406: R26.2 41,21.42 41,25.3 42.1,26.4 44.2,26.4 45.4,27.6 45.4,33.6 44.8,34.2 44.8,35.2 45.7,36.1 45.7,37.7 v46,38
  Bottom 0.406: IC1.15 42.37,37.7 45.7,37.7 v46,38
D9OUT_SW1
  Top 0.406: Q10.3 42.1,10.8 42.1,8.4 40.47,6.77 JP3.3
D10_MSFT3  (via drill 0.35)
  Top 0.406: R28.2 47,21.42 47,36.3 v47.6,36.9
  Bottom 0.406: IC1.16 38.47,37.73 39.3,36.9 v47.6,36.9
D10OUT_SW2
  Top 0.406: Q11.3 48.1,10.8 48.1,8.2 46.67,6.77 JP2.3
D11_E  (via drill 0.35)
  Top 0.406: v59.1,41 59.26,41.16 U$4.6
  Bottom 0.406: IC1.17 35.93,40.03 37.2,41.3 58.8,41.3 v59.1,41
D12_RS
  Bottom 0.406: IC1.18 33.39,40.69 34.8,42.1 63.8,42.1 64.34,42.64 U$4.4
D13_MSFT4  (via drill 0.35)
  Top 0.406: R29.2 53,21.42 53,25.1 52.5,25.6 49.6,25.6 48.6,26.6 48.6,33.2 49.3,33.9 v49.3,35.2
  Bottom 0.406: IC1.19 30.85,37.25 32,36.1 46.6,36.1 47.5,35.2 v49.3,35.2
D13OUT_SW3
  Top 0.406: Q12.3 54.1,10.8 54.1,8.1 52.77,6.77 JP1.3
D+
  Top 0.406: J1.D+ 13,9.6 15.04,11.63 U$2.5
D-
  Top 0.406: U$2.6 14.9,12.9 12.35,10.35 J1.D-
GND  (via drill 0.35, 4)
  Top 0.254: VREG1.4 | v63.91,24.09 v63.9,24.1 | 63.94,25.36 v63.9,25.4 | 63.94,26.64 v63.9,26.6 | v63.91,27.91 v63.9,27.9
  Top 0.406: J1.GND 14.3,5.16 14.97,5.83 | 14.97,5.83 U$2.1 | 14.97,5.83 15.57,5.83 v15.8,5.6 | C5.2 13,21.4 | 13,21.4 C9.2 | 13,21.4 v13,20.8 | C11.2 39.6,23.4 v40,23 39.7,23 38.2,21.5 34,21.5 | C12.2 46,23.6 v46,23 | C13.2 51.6,23.4 v52,23 | Q10.2 v38.5,14.5 | Q11.2 v44.5,14.5 | Q12.2 v50.5,14.5 | IC1.8 25.77,29.38 C4.2 | IC1.22 23.21,39.08 C3.1 | C1.2 32.5,23.11 | 32.5,23.11 34.05,23.11 C2.2 | 32.5,23.11 v32.5,24.2 | 34,21.5 32.8,21.5 32.5,21.8 32.5,23.11 | C64.C 34,21.5
  Top 0.508: D2.2 77.68,16.02
  Top 0.813: VREG1.4 v70.6,28.7 | VREG1.8 v63.91,24.09 | VREG1.7 63.94,25.36 | VREG1.6 63.94,26.64 | VREG1.5 v63.91,27.91 | C15.C v64.8,36 | LED2.3-GND 11.43,82.37 v11.4,82.4 | LED3.3-GND 19.43,74.27 v19.4,74.3 | LED4.3-GND v28.5,67.7 | LED5.3-GND 46.5,66.7 v46.5,67.7 | LED6.3-GND v57.1,70.9 | LED7.3-GND 65,77.53 v65,78.8 | LED8.3-GND 71.35,89.75 v71.4,89.8 | JP6.1 9.74,94.74 8.65,93.65 LED1.3-GND
  Bottom 0.406: U$4.16 33.86,42.56 33.4,42.1 24.9,42.1 23.2,40.4 23.23,40.37 IC1.22
  Bottom 0.813: v64.8,36 66.58,37.78 C10.- | v40,65 40,61 40,51 42.1,48.9 R1.A
  Bottom 1.016: JP1.1 JP2.1 JP3.1 38.81,1.69 37,3.5 v37,13 37,13.5 38,14.5 v38.5,14.5 41,14.5 | v52,23 v46,23 41,23 | 41,23 v40,23 | v50.5,14.5 v44.5,14.5 41,14.5 | 41,14.5 41,23
  other vias: 78,17.3 77,17.3 79,17.3 58.9,22.4 58.9,21.4 56.6,22.4 56.6,21.4 58.9,20.4 56.6,20.4 7.9,2 12.8,13.6 8.1,9 11.2,17.9 6.2,16.8 7.1,25.1 15.9,34.2 29.7,41.5 5,83 75,83
  pour Top (isolate 0.254, rank 6): 0.2,56 80,56 80,0.1 0.2,0.1 0,0.3 0,55.8
  pour Bottom (isolate 0.254, rank 6): 0.2,56 80,56 80,0.1 0.2,0.1 0,0.3 0,55.8
  pour Bottom: 15,100 0,100 0,75 arc90 15,60 65,60 arc90 79.93,74.93 arc45 80,75.11 80,100 65,100 65,95 arc-180 15,95
N$1
  Top 0.406: Q1.1 61.42,22.66 R3.2
N$2
  Top 0.406: U$2.13 8.44,10.37 7.6,11.2 C6.1
N$3
  Top 0.406: IC1.9 28.3,30.7 29.79,29.21 Q2.2 28.21,25.39 C1.1
N$4  (via drill 3.2)
  other vias: 77.55,43.55
N$5
  Top 0.406: IC1.10 30.8,31.39 30.8,28.7 32.53,26.97 Q2.1 36.87,24.97 C2.1
N$6  (via drill 3.2)
  other vias: 2.35,43.55
N$7  (via drill 3.2)
  other vias: 2.35,12.55
N$8  (via drill 3.2)
  other vias: 77.55,12.55
N$9
  Top 0.406: U$2.7 14.62,14.18 13,15.8 13,18.4 11.4,20 12MHZ.1 9.19,18.6 C5.1
N$10
  Top 0.406: U$4.15 34.95,42.1 33.1,42.1 31.62,43.58 R4.2
N$11
  Top 0.406: U$2.8 14.55,15.45 13.8,16.2 13.8,18.39 12MHZ.2 16.81,18.6 C9.1
N$12
  Top 0.406: U$2.4 17.96,10.37 18.6,11 C8.1
N$13  (via drill 4)
  other vias: 3,5
N$14  (via drill 4)
  other vias: 77,5
N$15  (via drill 4)
  other vias: 77,51
N$16  (via drill 4)
  other vias: 3,51
N$17
  Top 0.813: LED2.4-DIN 12.57,78.57 14,80 14,83.2 LED1.2-DOUT
N$18
  Top 0.813: LED2.2-DOUT 12.9,74.77 LED3.4-DIN
N$19
  Top 0.813: LED3.2-DOUT 22.9,69 LED4.4-DIN
N$20
  Top 0.813: LED5.4-DIN 45.65,63.35 44,65 44,67 42,69 35.8,69 LED4.2-DOUT
N$21
  Top 0.813: LED5.2-DOUT 58.98,66.65 LED6.4-DIN
N$22
  Top 0.813: LED6.2-DOUT 65.23,72.9 LED7.4-DIN
N$23
  Top 0.813: LED8.4-DIN 68.57,82.47 LED7.2-DOUT
N$27
  Top 0.813: JP6.2 7.2,95.3 LED1.4-DIN
N$81
  Top 0.406: Q10.1 40.95,15.85 40,16.8 R26.1
N$82
  Top 0.406: Q11.1 46.95,15.85 46,16.8 R28.1
N$83
  Top 0.406: Q12.1 52.95,15.85 52,16.8 R29.1
N$292
  pour Top (isolate 0.305, no thermals): 68.4,25.9 68.4,24.9 72.2,24.9 72.4,24.7 72.4,22.1 72.5,22 76.5,22 76.9,21.6 76.9,19.1 79.8,19.1 79.8,25.9
RESET  (via drill 0.35)
  Top 0.406: IC1.1 7.99,33.01 7.1,33.9 3.92,33.9 R2.1 4,33.78 4,17 6,15 v6.5,15 C6.2
  Bottom 0.406: v6.5,15 7.5,14 7.5,13.32 14.12,6.7 17.9,6.7 20.7,3.9 S1.1
SCL
  Top 0.406: IC1.28 7.99,43.5 JP5.4
SDA
  Top 0.406: IC1.27 10.53,43.5 JP5.3
VUSB
  Top 0.406: J1.VBUS 10.3,6.12 U$2.16 8.64,6.55 5.2,10 5.2,14.45 D11.A

### Text on the board
tPlace: 5V | SIG | GND | CALIBRATE | CONTRAST | - | + | - | + | I2C | SCL | SDA | 5V | GND | SG | DBL | GO | 5V | 12V | 5V | 12V | 5V | 12V | D8 | V-IN | PIXL | 5V | 5V | OUT1 | D9 | OUT2 | D10 | OUT3 | D13 | D6 | SW | A1 | SW | A2 | SW | A3 | PXL | + | GND | GND | GND | GND | GND | GND | GND | GND | PUMP | - | + | PWR IN | -